# Altium project MSP30_CC110L.PrjPcb
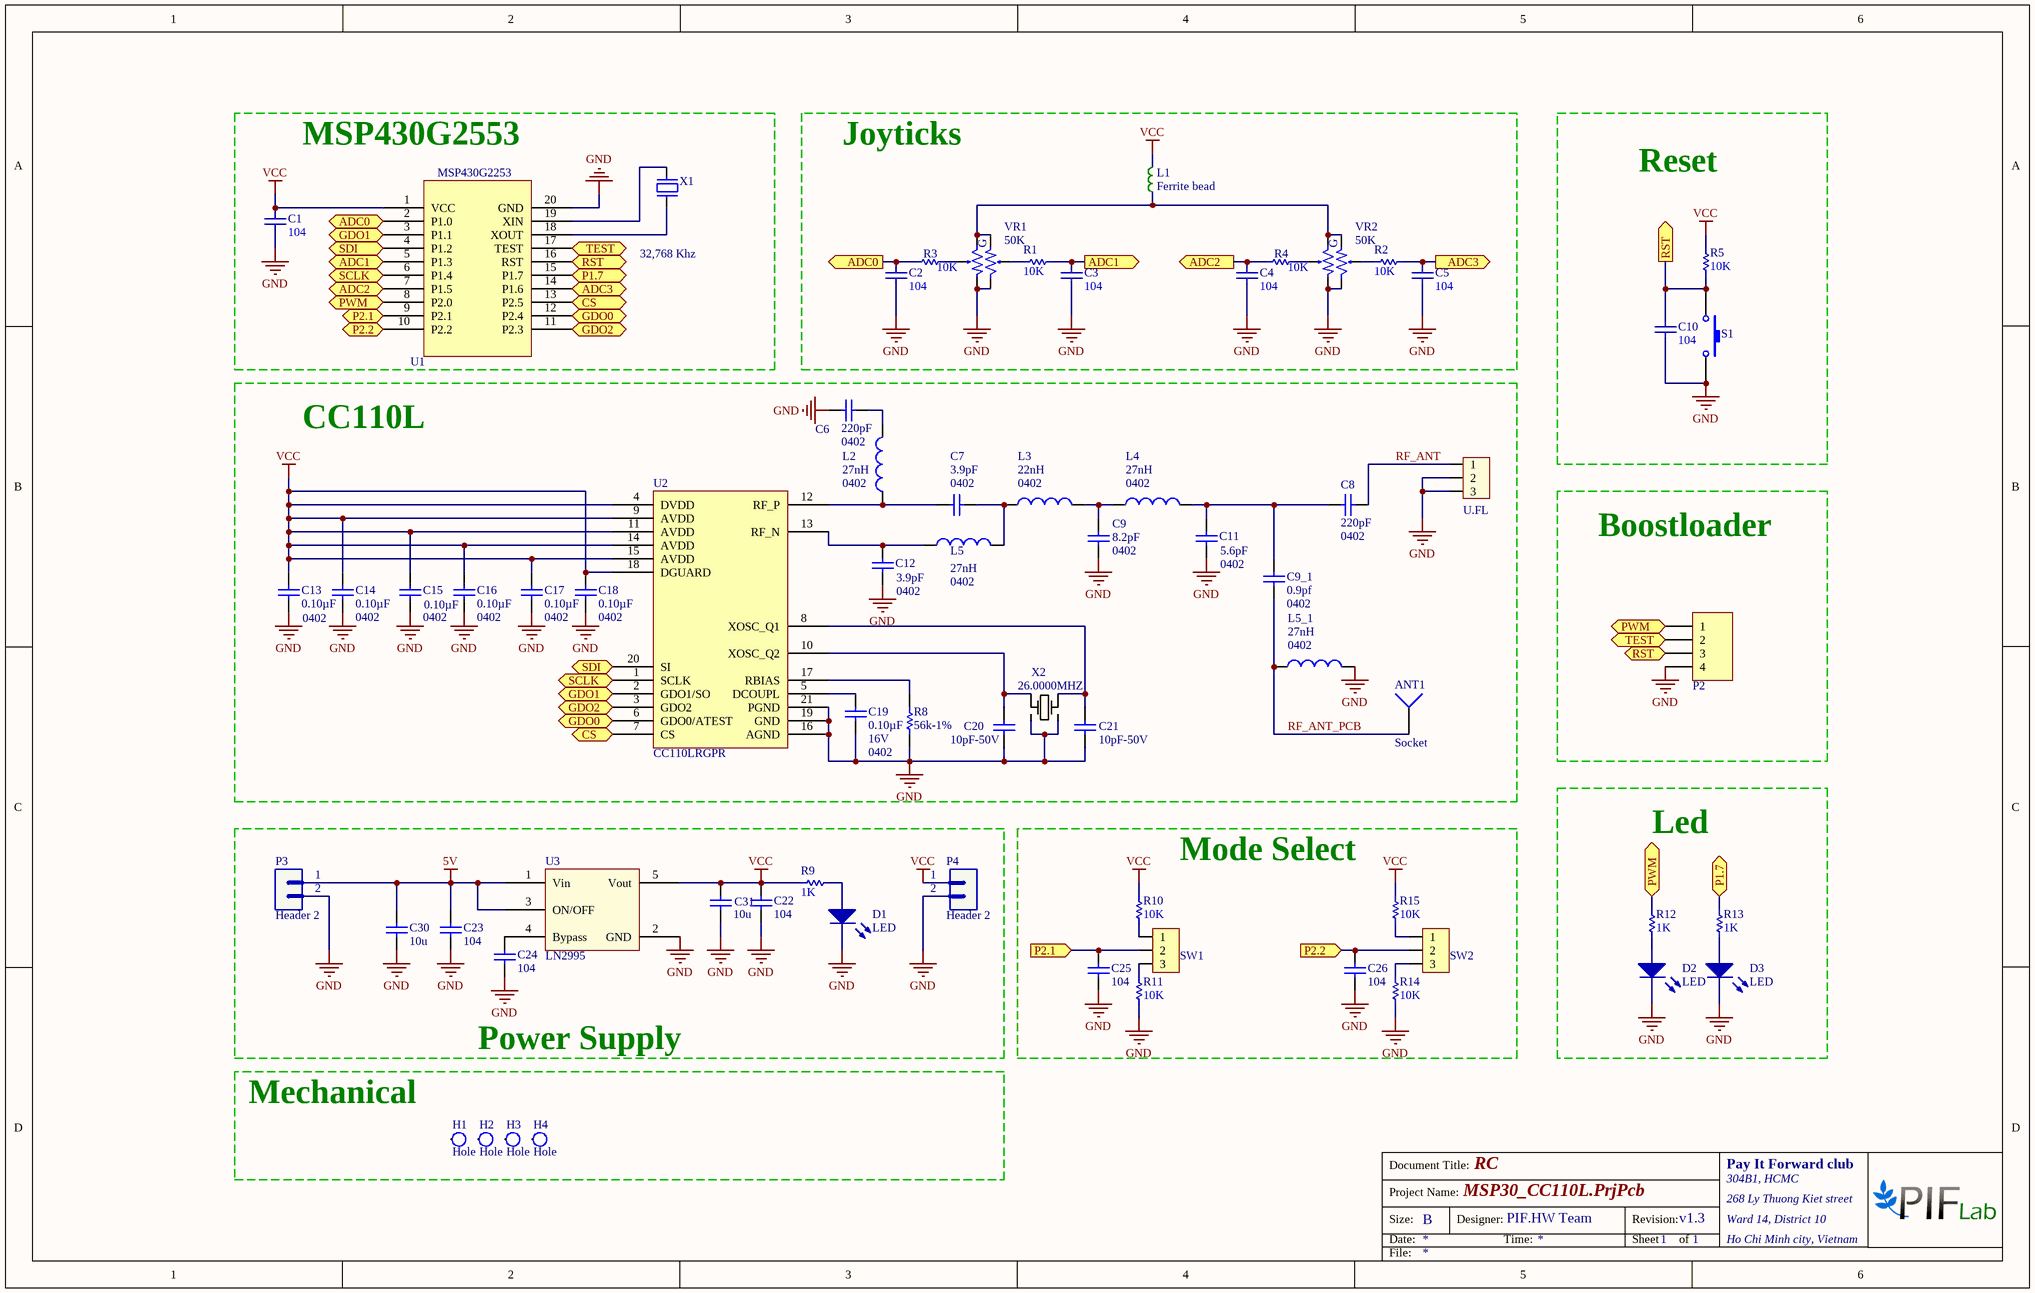
[diagram p0: RYA_KiteUp_RC.SchDoc]
1 sheet, 70 parts. Net scope: flat (ports and power ports of the same name join across sheets).
Board file: RYA_KiteUp_RC.PcbDoc

## Sheet RYA_KiteUp_RC.SchDoc: RC
size B; Author: PIF.HW Team; DrawnBy: PIF.HW Team; Organization: Pay It Forward club; Address1: 304B1, HCMC; Address2: 268 Ly Thuong Kiet street; Address3: Ward 14, District 10; Address4: Ho Chi Minh city, Vietnam; DocumentNumber: 1; Revision: v1.3; SheetNumber: 1; SheetTotal: 1

### Parts
ANT1  Socket  [433_Antenna]
C1  value 104  [CAP-SM-0805]  (hidden comment: Cap Non-Pol SMD)
C2  value 104  [CAP-SM-0603]  (hidden comment: Cap Non-Pol SMD)
C3  value 104  [CAP-SM-0603]  (hidden comment: Cap Non-Pol SMD)
C4  value 104  [CAP-SM-0603]  (hidden comment: Cap Non-Pol SMD)
C5  value 104  [CAP-SM-0603]  (hidden comment: Cap Non-Pol SMD)
C6  Capacitance: 220pF  [0402]
C7  Capacitance: 3.9pF  [0402]
C8  Capacitance: 220pF  [0402]  (no BOM)
C9  Capacitance: 8.2pF  [0402]
C9_1  Capacitance: 0.9pf  [0402]
C10  value 104  [CAP-SM-0603]  (hidden comment: Cap Non-Pol SMD)
C11  Capacitance: 5.6pF  [0402]
C12  Capacitance: 3.9pF  [0402]
C13  Capacitance: 0.10µF  [0402]  (hidden comment: 100nF-16V)
C14  Capacitance: 0.10µF  [0402]  (hidden comment: 100nF-16V)
C15  Capacitance: 0.10µF  [0402]  (hidden comment: 100nF-16V)
C16  Capacitance: 0.10µF  [0402]  (hidden comment: 100nF-16V)
C17  Capacitance: 0.10µF  [0402]  (hidden comment: 100nF-16V)
C18  Capacitance: 0.10µF  [0402]  (hidden comment: 100nF-16V)
C19  Capacitance: 0.10µF  Voltage - Rated: 16V  [0402]  (hidden comment: 100nF-16V)
C20  10pF-50V  [0402]
C21  10pF-50V  [0402]
C22  value 104  [CAP-SM-0603]  (hidden comment: Cap Non-Pol SMD)
C23  value 104  [CAP-SM-0603]  (hidden comment: Cap Non-Pol SMD)
C24  value 104  [CAP-SM-0603]  (hidden comment: Cap Non-Pol SMD)
C25  value 104  [CAP-SM-0603]  (hidden comment: Cap Non-Pol SMD)
C26  value 104  [CAP-SM-0603]  (hidden comment: Cap Non-Pol SMD)
C30  value 10u  [CAP-SM-0603]  (hidden comment: Cap Non-Pol SMD)
C31  value 10u  [CAP-SM-0603]  (hidden comment: Cap Non-Pol SMD)
D1  LED  [LED_0603_Blue]
D2  LED  [LED_0603_Blue]
D3  LED  [LED_0603_Blue]
H1  Hole  [Screw 3.0]
H2  Hole  [Screw 3.0]
H3  Hole  [Screw 3.0]
H4  Hole  [Screw 3.0]
HD1  U.FL  [PCBComponent_1]
L1  Ferrite bead  [FERRITE SMD 0805]
L2  Inductance: 27nH  Package / Case: 0402  [0402-A]
L3  Inductance: 22nH  Package / Case: 0402  [0402-A]
L4  Inductance: 27nH  Package / Case: 0402  [0402-A]
L5  Inductance: 27nH  Package / Case: 0402  [0402-A]
L5_1  Inductance: 27nH  Package / Case: 0402  [0402-A]
P2  Header 4  [JP4]  (value not drawn)
P3  Header 2  [JP2]
P4  Header 2  [JP2]
R1  value 10K  [RES-SM-0603]  (hidden comment: Res SMD)
R2  value 10K  [RES-SM-0603]  (hidden comment: Res SMD)
R3  value 10K  [RES-SM-0603]  (hidden comment: Res SMD)
R4  value 10K  [RES-SM-0603]  (hidden comment: Res SMD)
R5  value 10K  [RES-SM-0603]  (hidden comment: Res SMD)
R8  56k-1%  [RES-SMD-0402]
R9  value 1K  [RES-SM-0603]  (hidden comment: Res SMD)
R10  value 10K  [RES-SM-0603]  (hidden comment: Res SMD)
R11  value 10K  [RES-SM-0603]  (hidden comment: Res SMD)
R12  value 1K  [RES-SM-0603]  (hidden comment: Res SMD)
R13  value 1K  [RES-SM-0603]  (hidden comment: Res SMD)
R14  value 10K  [RES-SM-0603]  (hidden comment: Res SMD)
R15  value 10K  [RES-SM-0603]  (hidden comment: Res SMD)
S1  Tact SW - 2Pin  [SW2]  (value not drawn)
SW1  SW3  [PCBComponent_1]  (value not drawn)
SW2  (no value)  [PCBComponent_1]
U1  MSP430G2553  [TSSOP20]  (value not drawn)
U2  CC110LRGPR  [VQFN20]
U3  LN2995  [SOT23-5]
VR1  50K  [PCBComponent_1]
VR2  50K  [PCBComponent_1]
X1  32,768 Khz  [XTAL 32KN]  (no BOM)
X2  26.0000MHZ  [Crystal SMD 3.2x2.5]

### Blocks framed on the sheet
MSP430G2553: C1 U1 X1
Joyticks: C2-C5 L1 R1-R4 VR1 VR2
Reset: C10 R5 S1
CC110L: ANT1 C6-C9 C9_1 C11-C21 HD1 L2-L5 L5_1 R8 U2 X2
Boostloader: P2
Led: D2 D3 R12 R13
Power Supply: C22-C24 C30 C31 D1 P3 P4 R9 U3
Mode Select: C25 C26 R10 R11 R14 R15 SW1 SW2

### Ports
ADC0 (in), ADC0 (out), ADC1 (in), ADC1 (out), ADC2 (in), ADC2 (out), ADC3 (in), ADC3 (out), CS (in), CS (out), GDO0, GDO0 (out), GDO1 (in), GDO1 (out), GDO2 (in), GDO2 (out), P1.7 (in), P1.7 (out), P2.1 (in), P2.1 (out), P2.2 (in), P2.2 (out), PWM (bidir), PWM (out), RST (in), RST (out), SCLK (in), SCLK (out), SDI (in), SDI (out), TEST (in), TEST (out)

### Nets
5V: C23.2 C30.2 P3.1 U3.1(Vin) U3.3(ON/OFF)
GND: C1.2 C2.1 C3.1 C4.1 C5.1 C6.1 C9.1 C10.2 C11.1 C12.2 C13.1 C14.2 C15.2 C16.2 C17.2 C18.2 C19.1 C20.1 C21.1 C22.1 C23.1 C24.1 C25.1 C26.1 C30.1 C31.1 D1.2(K) D2.2(K) D3.2(K) HD1.2 HD1.3 L5_1.1 P2.4 P3.2 P4.2 R8.1 R11.1 R14.1 S1.2 U1.20(GND) U2.16(AGND) U2.19(GND) U2.21(PGND) U3.2(GND) VR1.3 VR1.6 VR2.3 VR2.6 X2.2(GND) X2.4(GND)
VCC: C1.1 C13.2 C14.1 C15.1 C16.1 C17.1 C18.1 C22.2 C31.2 L1.2 P4.1 R5.2 R9.2 R10.2 R15.2 U1.1(VCC) U2.4(DVDD) U2.9(AVDD) U2.11(AVDD) U2.14(AVDD) U2.15(AVDD) U2.18(DGUARD) U3.5(Vout)
RF_ANT: C8.2 HD1.1
RF_ANT_PCB: ANT1.1 C9_1.1 L5_1.2
NetC2_2: C2.2 R3.2 U1.2(P1.0) ; port ADC0
NetC3_2: C3.2 R1.1 U1.5(P1.3) ; port ADC1
NetC4_2: C4.2 R4.2 U1.7(P1.5) ; port ADC2
NetC5_2: C5.2 R2.1 U1.14(P1.6) ; port ADC3
NetC6_2: C6.2 L2.1
NetC7_1: C7.1 L2.2 U2.12(RF_P)
NetC7_2: C7.2 L3.2 L5.1
NetC8_1: C8.1 C9_1.2 C11.2 L4.1
NetC9_2: C9.2 L3.1 L4.2
NetC10_1: C10.1 P2.3 R5.1 S1.1 U1.16(RST) ; port RST
NetC12_1: C12.1 L5.2 U2.13(RF_N)
NetC19_2: C19.2 U2.5(DCOUPL)
NetC20_2: C20.2 U2.10(XOSC_Q2) X2.1(HOT)
NetC21_2: C21.2 U2.8(XOSC_Q1) X2.3(HOT)
NetC24_2: C24.2 U3.4(Bypass)
NetC25_2: C25.2 SW1.2 U1.9(P2.1) ; port P2.1
NetC26_2: C26.2 SW2.2 U1.10(P2.2) ; port P2.2
NetD1_1: D1.1(A) R9.1
NetD2_1: D2.1(A) R12.1
NetD3_1: D3.1(A) R13.1
NetL1_1: L1.1 VR1.1 VR1.4 VR2.1 VR2.4
NetP2_1: P2.1 R12.2 U1.8(P2.0) ; port PWM
NetP2_2: P2.2 U1.17(TEST) ; port TEST
NetR1_2: R1.2 VR1.2
NetR2_2: R2.2 VR2.2
NetR3_1: R3.1 VR1.5
NetR4_1: R4.1 VR2.5
NetR8_2: R8.2 U2.17(RBIAS)
NetR10_1: R10.1 SW1.1
NetR11_2: R11.2 SW1.3
NetR13_2: R13.2 U1.15(P1.7) ; port P1.7
NetR14_2: R14.2 SW2.3
NetR15_1: R15.1 SW2.1
NetU1_3: U1.3(P1.1) U2.2(GDO1/SO) ; port GDO1
NetU1_4: U1.4(P1.2) U2.20(SI) ; port SDI
NetU1_6: U1.6(P1.4) U2.1(SCLK) ; port SCLK
NetU1_11: U1.11(P2.3) U2.3(GDO2) ; port GDO2
NetU1_12: U1.12(P2.4) U2.6(GDO0/ATEST) ; port GDO0
NetU1_13: U1.13(P2.5) U2.7(CS) ; port CS
NetU1_18: U1.18(XOUT) X1.1
NetU1_19: U1.19(XIN) X1.2

Not connected (* = marked no-connect by the designer): H1 1; H2 1; H3 1; H4 1

### Notes on the sheet
- Mechanical
- Document Title:
- Size:
- Date:
- Project Name:
- B
- Designer:
- Time:
- Revision:
- Sheet
- of
- File:
- (in symbol MSP430G2553) MSP430G2253
- (in symbol VR-D) G

### Library data of the parts
C1-C5 C10 C22-C26 C30 C31 = Cap Non-Pol SMD: Capacitor
C6 C8 C9_1 = 3.3pF-50V-C0402-0.25pF: CAP CER 3.9PF 50V NP0 0402; Manufacturer: Murata Electronics North America; Manufacturer Part Number: GRM1555C1H221JA01D; Tolerance: ±5%; Temperature Coefficient: C0G, NP0; Supplier 1: Digi-Key; Supplier Part Number 1: 490-1293-2-ND; RoHS: RoHS Compliant; Category: Capacitors; Stock 1: 470000; Pricing 1: 10000=0.00336, 20000=0.0032, 30000=0.00304, 50000=0.00272, 100000=0.0022 (USD); Packaging: Tape & Reel (TR); Voltage - Rated: 50V; Mounting Type: Surface Mount, MLCC; Operating Temperature: -55°C ~ 125°C; Applications: General Purpose; Ratings: -; Package / Case: 0402; Size / Dimension: 0.039" L x 0.020" W (1.00mm x 0.50mm); Height - Seated (Max): -; Thickness (Max): 0.022" (0.55mm); Lead Spacing: -; Features: -; Lead Style: -; ComponentLink1URL: http://www.murata.com/~/media/webrenewal/support/library/catalog/products/capacitor/mlcc/c02e.pdf; ComponentLink1Description: http://www.murata.com/~/media/webrenewal/support/library/catalog/products/capacitor/mlcc/c02e.pdf
C7 C12 = 3.3pF-50V-C0402-0.25pF: CAP CER 3.9PF 50V NP0 0402; Manufacturer: Murata Electronics North America; Manufacturer Part Number: GRM1555C1H3R9CZ01D; Tolerance: ±0.25pF; Temperature Coefficient: C0G, NP0; Supplier 1: Digi-Key; Supplier Part Number 1: 490-1272-2-ND; RoHS: RoHS Compliant; Category: Capacitors; Stock 1: 0; Pricing 1: 10000=0 (USD); Packaging: Tape & Reel (TR); Voltage - Rated: 50V; Mounting Type: Surface Mount, MLCC; Operating Temperature: -55°C ~ 125°C; Applications: General Purpose; Ratings: -; Package / Case: 0402; Size / Dimension: 0.039" L x 0.020" W (1.00mm x 0.50mm); Height - Seated (Max): -; Thickness (Max): 0.022" (0.55mm); Lead Spacing: -; Features: -; Lead Style: -; ComponentLink1URL: http://media.digikey.com/pdf/Data%20Sheets/Murata%20PDFs/Chip%20Monolithic%20Ceramic%20Caps.pdf; ComponentLink1Description: http://media.digikey.com/pdf/Data%20Sheets/Murata%20PDFs/Chip%20Monolithic%20Ceramic%20Caps.pdf
C9 = 8.2pF-50V-C0402-0.5pF: GRM1555C1H8R2CZ01D; Manufacturer: Murata Electronics North America; Tolerance: ±0.25pF; Voltage - Rated: 50V; Temperature Coefficient: C0G, NP0; Supplier 1: Digi-Key; Supplier Part Number 1: GRM1555C1H8R2CZ01D-ND; Manufacturer Part Number: GRM1555C1H8R2CZ01D; RoHS: RoHS Compliant; Category: Capacitors; Stock 1: 0; Pricing 1: 60000=0 (USD); Packaging: Tape & Reel (TR); Mounting Type: Surface Mount, MLCC; Operating Temperature: -55°C ~ 125°C; Applications: General Purpose; Ratings: -; Package / Case: 0402; Size / Dimension: 0.039" L x 0.020" W (1.00mm x 0.50mm); Height - Seated (Max): -; Thickness (Max): 0.022" (0.55mm); Lead Spacing: -; Features: -; Lead Style: -; ComponentLink1URL: http://media.digikey.com/pdf/Data%20Sheets/Murata%20PDFs/Chip%20Monolithic%20Ceramic%20Caps.pdf; ComponentLink1Description: http://media.digikey.com/pdf/Data%20Sheets/Murata%20PDFs/Chip%20Monolithic%20Ceramic%20Caps.pdf
C11 = 5.6pF-50V-C0402-0.5pF: CAP CER 5.6PF 50V NP0 0402; Manufacturer: Murata Electronics North America; Manufacturer Part Number: GRM1555C1H5R6CZ01D; Tolerance: ±0.25pF; Temperature Coefficient: C0G, NP0; Supplier 1: Digi-Key; Supplier Part Number 1: GRM1555C1H5R6CZ01D-ND; RoHS: RoHS Compliant; Category: Capacitors; Stock 1: 0; Pricing 1: 60000=0 (USD); Packaging: Tape & Reel (TR); Voltage - Rated: 50V; Mounting Type: Surface Mount, MLCC; Operating Temperature: -55°C ~ 125°C; Applications: General Purpose; Ratings: -; Package / Case: 0402; Size / Dimension: 0.039" L x 0.020" W (1.00mm x 0.50mm); Height - Seated (Max): -; Thickness (Max): 0.022" (0.55mm); Lead Spacing: -; Features: -; Lead Style: -; ComponentLink1URL: http://media.digikey.com/pdf/Data%20Sheets/Murata%20PDFs/Chip%20Monolithic%20Ceramic%20Caps.pdf; ComponentLink1Description: http://media.digikey.com/pdf/Data%20Sheets/Murata%20PDFs/Chip%20Monolithic%20Ceramic%20Caps.pdf
C13-C19 = 100nF-16V-C0402: CAP CER 0.1UF 16V Y5V 0402; Manufacturer: Yageo; Manufacturer Part Number: CC0402ZRY5V7BB104; Tolerance: -20%, +80%; Temperature Coefficient: Y5V (F); Digi-Key Part Number: 311-1047-2-ND; Unit Price: 0.0021; Supplier 1: Digi-Key; Supplier Part Number 1: 311-1047-6-ND; RoHS: RoHS Compliant; Category: Capacitors; Stock 1: 1728820; Pricing 1: 1=0.1, 10=0.013, 25=0.0092, 100=0.0059, 250=0.0048, 500=0.00412, 1000=0.00321, 2500=0.00289, 5000=0.00268 (USD); Packaging: Digi-Reel®; Mounting Type: Surface Mount, MLCC; Operating Temperature: -30°C ~ 85°C; Applications: General Purpose; Ratings: -; Package / Case: 0402; Size / Dimension: 0.039" L x 0.020" W (1.00mm x 0.50mm); Height - Seated (Max): -; Thickness (Max): 0.022" (0.55mm); Lead Spacing: -; Features: -; Lead Style: -; ComponentLink1URL: http://www.yageo.com/documents/recent/UPY-GPHC_Y5V_6.3V-to-50V_6.pdf; ComponentLink1Description: http://www.yageo.com/documents/recent/UPY-GPHC_Y5V_6.3V-to-50V_6.pdf
  C13-C18: Voltage - Rated: 16V
C20 C21 = 10pF-50V-C0402-5%: CAP CER 10PF 50V NPO 0402; Manufacturer: Yageo; Manufacturer Part Number: CC0402JRNPO9BN100; Digi-Key Part Number: 311-1014-1-ND; Unit Price: 0.00312
HD1 = Hed3: Header 3 (Green); Value: Header 3
L1 = Ferrite bead SMD-0805: EMI Ferrite Chip Bead,  0805,  500MA,  600Ohms @100MHz,  DCR Max 0.30Ohm; Manufacturer: Laird Technologies; Manufacturer Part Number: HZ0805E601R-10; Supplier 1: Allied; RoHS: No; Stock 1: 35030; Pricing 1: 1=0.0460, 25=0.0420, 100=0.0380, 250=0.0350, 500=0.0270 (USD); ComponentLink1URL: http://www.alliedelec.com/m/d/63159f83fbe70e1160794b0cc8ac128f.pdf; ComponentLink1Description: http://www.alliedelec.com/m/d/63159f83fbe70e1160794b0cc8ac128f.pdf; ComponentLink2URL: http://www.alliedelec.com/laird-technologies-hz0805e601r-10/70065489/; ComponentLink2Description: http://www.alliedelec.com/laird-technologies-hz0805e601r-10/70065489/
L2 L4 L5 L5_1 = 8.2nH-500mA-0402: FIXED IND 27NH 300MA 460 MOHM; Manufacturer: Murata Electronics North America; Manufacturer Part Number: LQG15HS27NJ02D; Type: Multilayer; Material - Core: Air; Tolerance: ±5%; Shielding: Unshielded; DC Resistance (DCR): 460 mOhm Max; Q @ Freq: 8 @ 100MHz; Frequency - Self Resonant: 1.7GHz; Frequency - Test: 100MHz; Supplier 1: Digi-Key; Supplier Part Number 1: 490-2628-2-ND; RoHS: RoHS Compliant; Category: Inductors, Coils, Chokes; Stock 1: 120000; Pricing 1: 10000=0.01872, 30000=0.01814, 50000=0.01755, 100000=0.01697 (USD); Packaging: Tape & Reel (TR); Current Rating: 300mA; Current - Saturation: -; Ratings: -; Operating Temperature: -55°C ~ 125°C; Mounting Type: Surface Mount; Size / Dimension: 0.039" L x 0.020" W (1.00mm x 0.50mm); Height - Seated (Max): 0.022" (0.55mm); ComponentLink1URL: http://search.murata.co.jp/Ceramy/image/img/PDF/ENG/L0075S0083LQG15HS.pdf; ComponentLink1Description: http://search.murata.co.jp/Ceramy/image/img/PDF/ENG/L0075S0083LQG15HS.pdf
L3 = 8.2nH-500mA-0402: FIXED IND 22NH 300MA 420 MOHM; Manufacturer: Murata Electronics North America; Manufacturer Part Number: LQG15HS22NJ02D; Type: Multilayer; Material - Core: Air; Tolerance: ±5%; Shielding: Unshielded; DC Resistance (DCR): 420 mOhm Max; Q @ Freq: 8 @ 100MHz; Frequency - Self Resonant: 1.9GHz; Frequency - Test: 100MHz; Supplier 1: Digi-Key; Supplier Part Number 1: 490-2627-1-ND; RoHS: RoHS Compliant; Category: Inductors, Coils, Chokes; Stock 1: 250711; Pricing 1: 1=0.1, 10=0.059, 25=0.0528, 50=0.0456, 100=0.041, 250=0.03804, 500=0.0351, 750=0.03335, 1000=0.03042 (USD); Packaging: Cut Tape (CT); Current Rating: 300mA; Current - Saturation: -; Ratings: -; Operating Temperature: -55°C ~ 125°C; Mounting Type: Surface Mount; Size / Dimension: 0.039" L x 0.020" W (1.00mm x 0.50mm); Height - Seated (Max): 0.022" (0.55mm); ComponentLink1URL: http://search.murata.co.jp/Ceramy/image/img/PDF/ENG/L0075S0083LQG15HS.pdf; ComponentLink1Description: http://search.murata.co.jp/Ceramy/image/img/PDF/ENG/L0075S0083LQG15HS.pdf
P2 = Header 4: Header, 4-Pin; LatestRevisionDate: 17-Jul-2002; LatestRevisionNote: Re-released for DXP Platform.; Publisher: Altium Limited
P3 P4 = Header 2: Header, 2-Pin; LatestRevisionDate: 17-Jul-2002; LatestRevisionNote: Re-released for DXP Platform.; Publisher: Altium Limited
R1-R5 R9-R15 = Res SMD: Resistor
R8 = 56k-1%-R0402: RES 56.0K OHM 1/16W 1% 0402 SMD; Manufacturer: Yageo; Manufacturer Part Number: RC0402FR-0756KL; Digi-Key Part Number: 311-56.0KLRTR-ND; Unit Price: 0.00149
S1 = Tact SW - 2Pin: Switch button 2 pin
SW1 SW2 = Header3: Header IDC, 3 x 1 Pin Vertical 2.54mm Pitch (Non-Boxed, Male); Manufacturer: W¨¹rth Elektronik eiSos GmbH; partNo: 613002143121; ComponentLink1 Description: Manufacturer; ComponentLink2 Description: Datasheet; NoPins: 02; Created Date: 29 March 2013; ComponentLink1URL: http://www.we-online.com; ComponentLink2URL: http://katalog.we-online.de/em/datasheet/6130xx143121.pdf; Created by: Karrer Zheng
U2 = CC110LRGPR: IC RF TXRX ISM<1GHZ 20-VFQFN; Manufacturer: Texas Instruments; RF Family/Standard: General ISM < 1GHz; Modulation: 2FSK, 4FSK, GFSK, MSK, OOK; Frequency: 300MHz ~ 348MHz, 387MHz ~ 464MHz, 779MHz ~ 928MHz; Data Rate (Max): 600kbps; Power - Output: 12dBm; Sensitivity: -116dBm; Serial Interfaces: SPI; Voltage - Supply: 1.8 V ~ 3.6 V; Current - Receiving: 14.3mA ~ 17.1mA; Current - Transmitting: 12.3mA ~ 34.2mA; Supplier 1: Digi-Key; RoHS: RoHS Compliant; Category: RF/IF and RFID; Stock 1: 0; Pricing 1: 3000=1.9285, 6000=1.84875, 15000=1.8125 (USD); Packaging: Tape & Reel (TR); Type: TxRx Only; Protocol: -; Memory Size: -; GPIO: -; Operating Temperature: -40°C ~ 85°C; Package / Case: 20-VFQFN Exposed Pad; ComponentLink1URL: http://www.ti.com/lit/ds/symlink/cc110l.pdf; ComponentLink1Description: http://www.ti.com/lit/ds/symlink/cc110l.pdf; Supplier Part Number 1: 296-35719-2-ND; Manufacturer Part Number: CC110LRGPR
U3 = Component_1
VR1 VR2 = VR-D: Volume control Dual; Value: Volume Dual 50K
X1 = XT32k: Crystal 32,768kHz for timer real; Value: 32,768khz
X2 = CX3225SB26000D0FFFCC: CRYSTAL 26.0000MHZ 8PF SMD; Manufacturer: AVX Corp/Kyocera Corp; Frequency: 26MHz; Frequency Stability: ±15ppm; Frequency Tolerance: ±10ppm; ESR (Equivalent Series Resistance): 50 Ohm; Operating Mode: Fundamental; Supplier 1: Digi-Key; RoHS: RoHS Compliant; Category: Crystals and Oscillators; Stock 1: 3000; Pricing 1: 3000=0.406, 6000=0.392, 15000=0.378 (USD); Packaging: Tape & Reel (TR); Type: MHz Crystal; Load Capacitance: 8pF; Operating Temperature: -20°C ~ 70°C; Ratings: -; Mounting Type: Surface Mount; Package / Case: 4-SMD, No Lead (DFN, LCC); Size / Dimension: 0.126" L x 0.098" W (3.20mm x 2.50mm); Height: 0.024" (0.60mm); ComponentLink1URL: http://media.digikey.com/pdf/Data%20Sheets/Optrex%20PDFs/CX3225SByyy00D0FFFCC_Spec.pdf; ComponentLink1Description: http://media.digikey.com/pdf/Data%20Sheets/Optrex%20PDFs/CX3225SByyy00D0FFFCC_Spec.pdf; Supplier Part Number 1: 1253-1354-2-ND; Manufacturer Part Number: CX3225SB26000D0FFFCC
ANT1 = Socket: LatestRevisionDate: 17-Jul-2002; LatestRevisionNote: Re-released for DXP Platform.; Publisher: Altium Limited